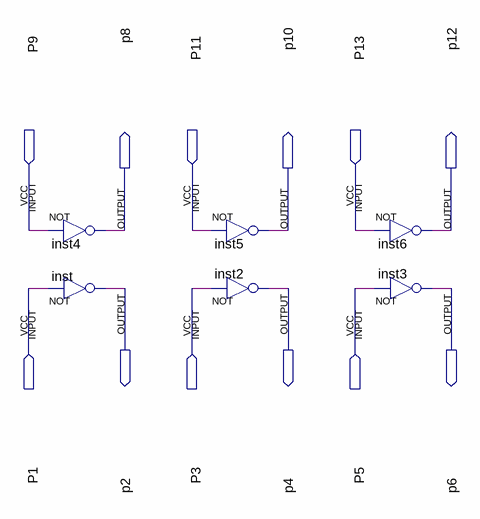
[diagram p0: schematic sheet]
// Quartus schematic ci_74ls04.bdf as structural Verilog: 6 symbols, 12 pins
module ci_74ls04 (
  input  P9,
  input  P11,
  input  P13,
  input  P1,
  input  P3,
  input  P5,
  output p8,
  output p10,
  output p12,
  output p2,
  output p4,
  output p6
);

  not inst4 (p8, P9);
  not inst (p2, P1);
  not inst5 (p10, P11);
  not inst2 (p4, P3);
  not inst6 (p12, P13);
  not inst3 (p6, P5);
endmodule
